# Altium schematic sheet adc_mcp3914.SchDoc
size A
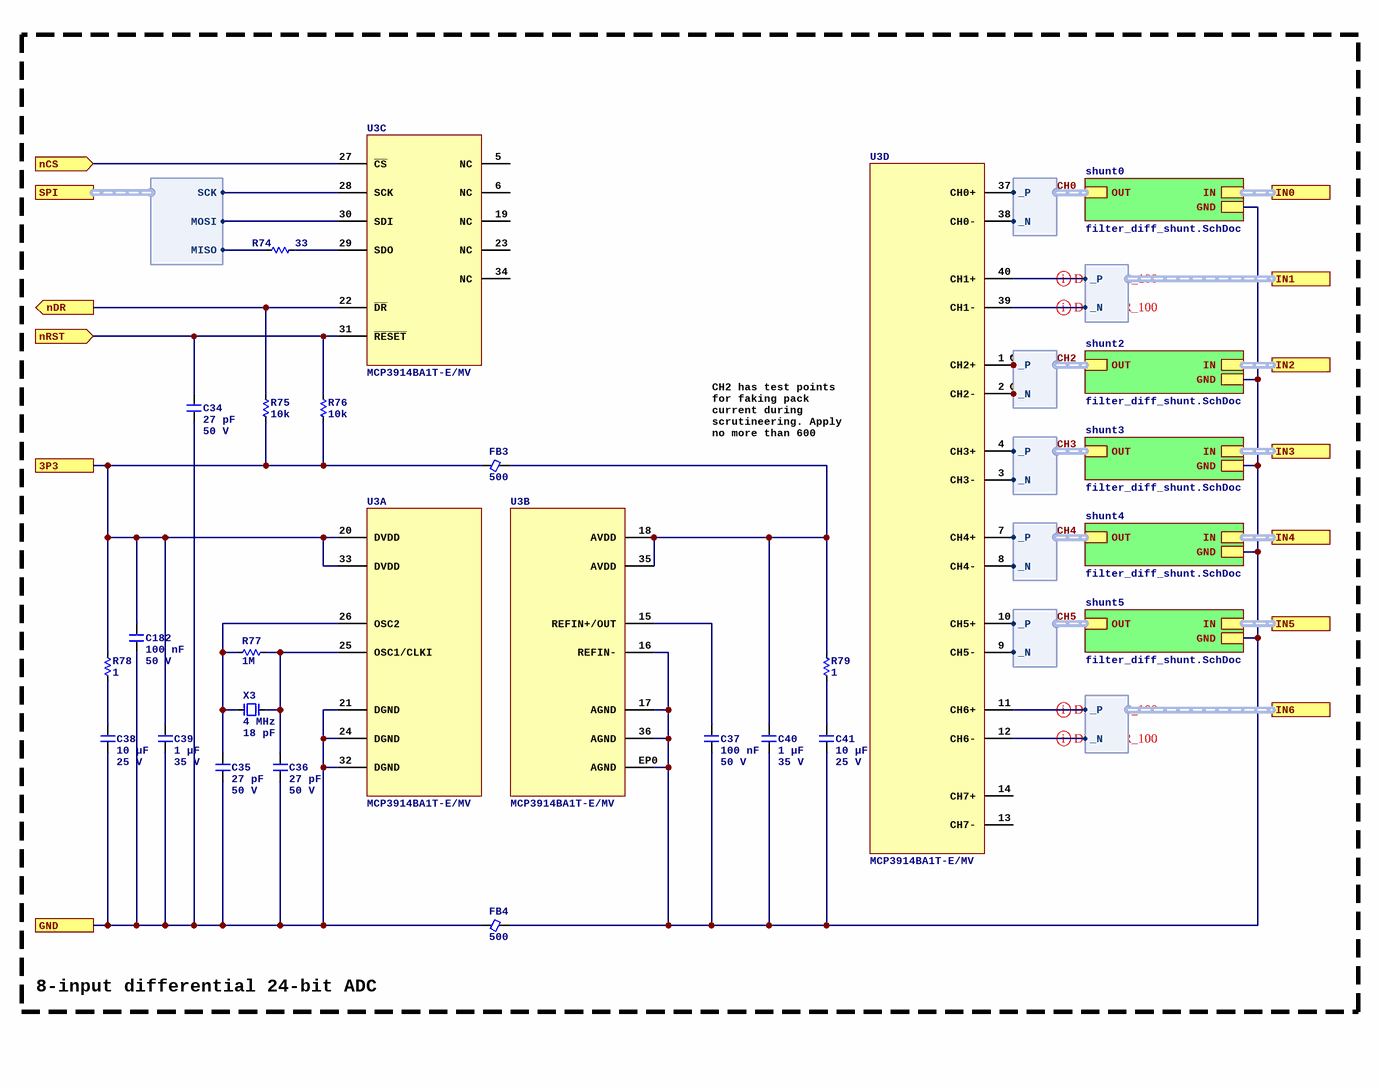
[diagram p0: adc_mcp3914.SchDoc]

## Parts
C34  Capacitance: 27 pF  Voltage Rating: 50 V  [C0402]  (hidden comment: 0402CG270J500NT)
C35  Capacitance: 27 pF  Voltage Rating: 50 V  [C0402]  (hidden comment: 0402CG270J500NT)
C36  Capacitance: 27 pF  Voltage Rating: 50 V  [C0402]  (hidden comment: 0402CG270J500NT)
C37  Capacitance: 100 nF  Voltage Rating: 50 V  [C0402]  (hidden comment: CL05B104KB54PNC)
C38  Capacitance: 10 µF  Voltage Rating: 25 V  [C0805]  (hidden comment: CL21B106KAYQNNE)
C39  Capacitance: 1 µF  Voltage Rating: 35 V  [C0603]  (hidden comment: GMK107AB7105KAHT)
C40  Capacitance: 1 µF  Voltage Rating: 35 V  [C0603]  (hidden comment: GMK107AB7105KAHT)
C41  Capacitance: 10 µF  Voltage Rating: 25 V  [C0805]  (hidden comment: CL21B106KAYQNNE)
C182  Capacitance: 100 nF  Voltage Rating: 50 V  [C0402]  (hidden comment: CL05B104KB54PNC)
FB3  Current Rating (mA): 500  [FB0402]  (hidden comment: BLM15AX601SN1D)
FB4  Current Rating (mA): 500  [FB0402]  (hidden comment: BLM15AX601SN1D)
R74  value 33  [R0402]  (hidden comment: 0402WGF330JTCE)
R75  value 10k  [R0402]  (hidden comment: 0402WGF1002TCE)
R76  value 10k  [R0402]  (hidden comment: 0402WGF1002TCE)
R77  value 1M  [R0402]  (hidden comment: 0402WGF1004TCE)
R78  value 1  [R0402]  (hidden comment: CRCW04021R00FKED)
R79  value 1  [R0402]  (hidden comment: CRCW04021R00FKED)
TP71  RH-5000  [TP_RH-5000]  (value not drawn)
TP72  RH-5001  [TP_RH-5001]  (value not drawn)
U3  MCP3914BA1T-E/MV  [MICROCHIP_MV]  (parts A,B,C,D of 4)
X3  Frequency: 4 MHz  Capacitance: 18 pF  [XTAL_HC49US_SMD]  (hidden comment: ABLS2-4.000MHZ-D4Y-T)

## Sub-sheets
shunt0 = filter_diff_shunt.SchDoc: IN (harness DIFF), OUT (harness DIFF), GND
shunt2 = filter_diff_shunt.SchDoc: IN (harness DIFF), OUT (harness DIFF), GND
shunt3 = filter_diff_shunt.SchDoc: IN (harness DIFF), OUT (harness DIFF), GND
shunt4 = filter_diff_shunt.SchDoc: IN (harness DIFF), OUT (harness DIFF), GND
shunt5 = filter_diff_shunt.SchDoc: IN (harness DIFF), OUT (harness DIFF), GND

## Ports
3P3, GND, IN0 (harness DIFF), IN1 (harness DIFF), IN2 (harness DIFF), IN3 (harness DIFF), IN4 (harness DIFF), IN5 (harness DIFF), IN6 (harness DIFF), nCS (in), nDR (out), nRST (in), SPI (harness SPI)

## Harnesses
DIFF: _N, _P
SPI: MISO, MOSI, SCK

## Nets
3P3: C39.1 C182.1 FB3.1 R75.2 R76.2 R78.2 U3.20(DVDD) U3.33(DVDD) ; port 3P3
CH0._N: U3.38(CH0-) ; sheet shunt0/OUT._N
CH0._P: U3.37(CH0+) ; sheet shunt0/OUT._P
CH2._N: TP72.1 U3.2(CH2-) ; sheet shunt2/OUT._N
CH2._P: TP71.1 U3.1(CH2+) ; sheet shunt2/OUT._P
CH3._N: U3.3(CH3-) ; sheet shunt3/OUT._N
CH3._P: U3.4(CH3+) ; sheet shunt3/OUT._P
CH4._N: U3.8(CH4-) ; sheet shunt4/OUT._N
CH4._P: U3.7(CH4+) ; sheet shunt4/OUT._P
CH5._N: U3.9(CH5-) ; sheet shunt5/OUT._N
CH5._P: U3.10(CH5+) ; sheet shunt5/OUT._P
GND: C34.2 C35.2 C36.2 C38.2 C39.2 C182.2 FB4.1 U3.21(DGND) U3.24(DGND) U3.32(DGND) ; port GND
nCS: U3.27(~{CS}) ; port nCS
nDR: R75.1 U3.22(~{DR}) ; port nDR
nRST: C34.1 R76.1 U3.31(~{RESET}) ; port nRST
NetC35_1: C35.1 R77.2 U3.26(OSC2) X3.2
NetC36_1: C36.1 R77.1 U3.25(OSC1/CLKI) X3.1
NetC37_1: C37.1 U3.15(REFIN+/OUT)
NetC37_2: C37.2 C40.2 C41.2 FB4.2 U3.16(REFIN-) U3.17(AGND) U3.36(AGND) U3.EP0(AGND) ; sheet shunt0/GND, sheet shunt2/GND, sheet shunt3/GND, sheet shunt4/GND, sheet shunt5/GND
NetC38_1: C38.1 R78.1
NetC40_1: C40.1 FB3.2 R79.2 U3.18(AVDD) U3.35(AVDD)
NetC41_1: C41.1 R79.1
NetR74_1: R74.1 U3.29(SDO)
NetR74_2: R74.2 ; port SPI.MISO
NetU3_11: U3.11(CH6+) ; port IN6._P
NetU3_12: U3.12(CH6-) ; port IN6._N
NetU3_28: U3.28(SCK) ; port SPI.SCK
NetU3_30: U3.30(SDI) ; port SPI.MOSI
NetU3_39: U3.39(CH1-) ; port IN1._N
NetU3_40: U3.40(CH1+) ; port IN1._P

Not connected (* = marked no-connect by the designer): U3 5(NC) 6(NC) 13(CH7-) 14(CH7+) 19(NC) 23(NC) 34(NC)

## Buses and harness runs
harness CH0 = sheet shunt0/OUT
harness CH2 = sheet shunt2/OUT
harness CH3 = sheet shunt3/OUT
harness CH4 = sheet shunt4/OUT
harness CH5 = sheet shunt5/OUT
harness port IN0 = sheet shunt0/IN
harness port IN2 = sheet shunt2/IN
harness port IN3 = sheet shunt3/IN
harness port IN4 = sheet shunt4/IN
harness port IN5 = sheet shunt5/IN

## Layout directives
differential pair; differential pair class DE_100: NetU3_11, NetU3_12, NetU3_39, NetU3_40

## Notes on the sheet
- CH2 has test points for faking pack current during scrutineering. Apply no more than 600 millivolts of either polarity.
- 8-input differential 24-bit ADC

## Library data of the parts
C34-C36 = 0402CG270J500NT: Manufacturer: FH(Guangdong Fenghua Advanced Tech); Dielectric: C0G; ComponentLink1URL: https://wmsc.lcsc.com/wmsc/upload/file/pdf/v2/lcsc/2304140030_FH--Guangdong-Fenghua-Advanced-Tech-0402CG270J500NT_C1557.pdf; ComponentLink1Description: Datasheet; Manufacturer Part Number: 0402CG270J500NT; Package: 0402; Supplier 2: LCSC; Supplier Part Number 2: C1557
C37 C182 = CL05B104KB54PNC: Manufacturer: Samsung Electro-Mechanics; Dielectric: X7R; ComponentLink1URL: https://wmsc.lcsc.com/wmsc/upload/file/pdf/v2/lcsc/2304140030_Samsung-Electro-Mechanics-CL05B104KB54PNC_C307331.pdf; ComponentLink1Description: Datasheet; Manufacturer Part Number: CL05B104KB54PNC; Package: 0402; Supplier 2: LCSC; Supplier Part Number 2: C307331
C38 C41 = CL21B106KAYQNNE: Manufacturer: Samsung Electro-Mechanics; Dielectric: X7R; ComponentLink1URL: https://datasheet.lcsc.com/lcsc/2206222030_Samsung-Electro-Mechanics-CL21B106KAYQNNE_C3039694.pdf; ComponentLink1Description: Datasheet; Manufacturer Part Number: CL21B106KAYQNNE; Package: 0805; Supplier 2: LCSC; Supplier Part Number 2: C3039694
C39 C40 = GMK107AB7105KAHT: Manufacturer: Taiyo Yuden; Dielectric: X7R; ComponentLink1URL: https://datasheet.lcsc.com/lcsc/2304140030_Taiyo-Yuden-GMK107AB7105KAHT_C841050.pdf; ComponentLink1Description: Datasheet; Manufacturer Part Number: GMK107AB7105KAHT; Package: 0603; Supplier 2: LCSC; Supplier Part Number 2: C841050
FB3 FB4 = BLM15AX601SN1D: Manufacturer: Murata Electronics; Z @ 100 MHz: 600; DCR (mOhms): 340; ComponentLink1URL: https://wmsc.lcsc.com/wmsc/upload/file/pdf/v2/lcsc/2304140030_Murata-Electronics-BLM15AX601SN1D_C76886.pdf; ComponentLink1Description: Datasheet; Manufacturer Part Number: BLM15AX601SN1D; Supplier 2: LCSC; Supplier Part Number 2: C76886; Package: 0402
R74 = 0402WGF330JTCE: Manufacturer: UNI-ROYAL(Uniroyal Elec); Tolerance: 1%; Temperature Coefficient: ±100ppm/?; Power Rating (mW): 62.5; ComponentLink1Description: Datasheet; ComponentLink1URL: https://wmsc.lcsc.com/wmsc/upload/file/pdf/v2/lcsc/2205311900_UNI-ROYAL-Uniroyal-Elec-0402WGF330JTCE_C25105.pdf; Manufacturer Part Number: 0402WGF330JTCE; Package: 0402; Supplier 2: LCSC; Supplier Part Number 2: C25105
R75 R76 = 0402WGF1002TCE: Manufacturer: UNI-ROYAL(Uniroyal Elec); Tolerance: 1%; Temperature Coefficient: ±100ppm/?; Power Rating (mW): 62.5; ComponentLink1Description: Datasheet; ComponentLink1URL: https://wmsc.lcsc.com/wmsc/upload/file/pdf/v2/lcsc/2206010100_UNI-ROYAL-Uniroyal-Elec-0402WGF1002TCE_C25744.pdf; Manufacturer Part Number: 0402WGF1002TCE; Package: 0402; Supplier 2: LCSC; Supplier Part Number 2: C25744
R77 = 0402WGF1004TCE: Manufacturer: UNI-ROYAL(Uniroyal Elec); Tolerance: 1%; Temperature Coefficient: ±100ppm/?; Power Rating (mW): 62.5; ComponentLink1Description: Datasheet; ComponentLink1URL: https://wmsc.lcsc.com/wmsc/upload/file/pdf/v2/lcsc/2206010030_UNI-ROYAL-Uniroyal-Elec-0402WGF1004TCE_C26083.pdf; Manufacturer Part Number: 0402WGF1004TCE; Package: 0402; Supplier 2: LCSC; Supplier Part Number 2: C26083
R78 R79 = CRCW04021R00FKED: Manufacturer: Vishay Intertech; Tolerance: 1%; Temperature Coefficient: ±100ppm/?; Power Rating (mW): 63; ComponentLink1Description: Datasheet; ComponentLink1URL: https://wmsc.lcsc.com/wmsc/upload/file/pdf/v2/lcsc/2211030200_Vishay-Intertech-CRCW04021R00FKED_C482087.pdf; Manufacturer Part Number: CRCW04021R00FKED; Package: 0402; Supplier 2: LCSC; Supplier Part Number 2: C482087
TP71 = RH-5000: Red through-hole PCB test point; Manufacturer: ronghe; ComponentLink1Description: Datasheet; ComponentLink1URL: https://datasheet.lcsc.com/lcsc/2307040929_ronghe-RH-5000_C5277086.pdf; Manufacturer Part Number: RH-5000; Supplier 2: LCSC; Supplier Part Number 2: C5277086
TP72 = RH-5001: Black through-hole PCB test point; Manufacturer: ronghe; ComponentLink1Description: Datasheet; ComponentLink1URL: https://datasheet.lcsc.com/lcsc/2307040929_ronghe-RH-5000_C5277086.pdf; Manufacturer Part Number: RH-5001; Supplier 2: LCSC; Supplier Part Number 2: C5199801
U3 = MCP3914BA1T-E/MV: 8 Channel AFE 24 Bit 40-UQFN (5x5); Manufacturer: Microchip; Manufacturer Part Number: MCP3914BA1T-E/MV; Supplier 1: DigiKey; Supplier Part Number 1: 150-MCP3914BA1T-E/MVCT-ND; Supplier 3: Mouser; Supplier Part Number 3: 579-MCP3914BA1T-E/MV; ComponentLink1Description: Datasheet; ComponentLink1URL: https://ww1.microchip.com/downloads/aemDocuments/documents/MSLD/ProductDocuments/MCP3914B-Data-Sheet-DS20007010.pdf
X3 = ABLS2-4.000MHZ-D4Y-T: CRYSTAL 4.000 MHZ 18PF SMD; Manufacturer: Abracon LLC; Supplier 1: DigiKey; Manufacturer Part Number: ABLS2-4.000MHZ-D4Y-T; ComponentLink1URL: http://www.abracon.com/Resonators/ABLS2.pdf; ComponentLink1Description: Datasheet; Supplier Part Number 1: 535-9857-1-ND; Supplier 2: LCSC; Supplier Part Number 2: C5933228; Supplier 3: Mouser; Supplier Part Number 3: 815-ABLS2-4-D4Y-T